# Altium schematic sheet BatteryCharger.SchDoc
size A3; SheetNumber: 2; SheetTotal: 8
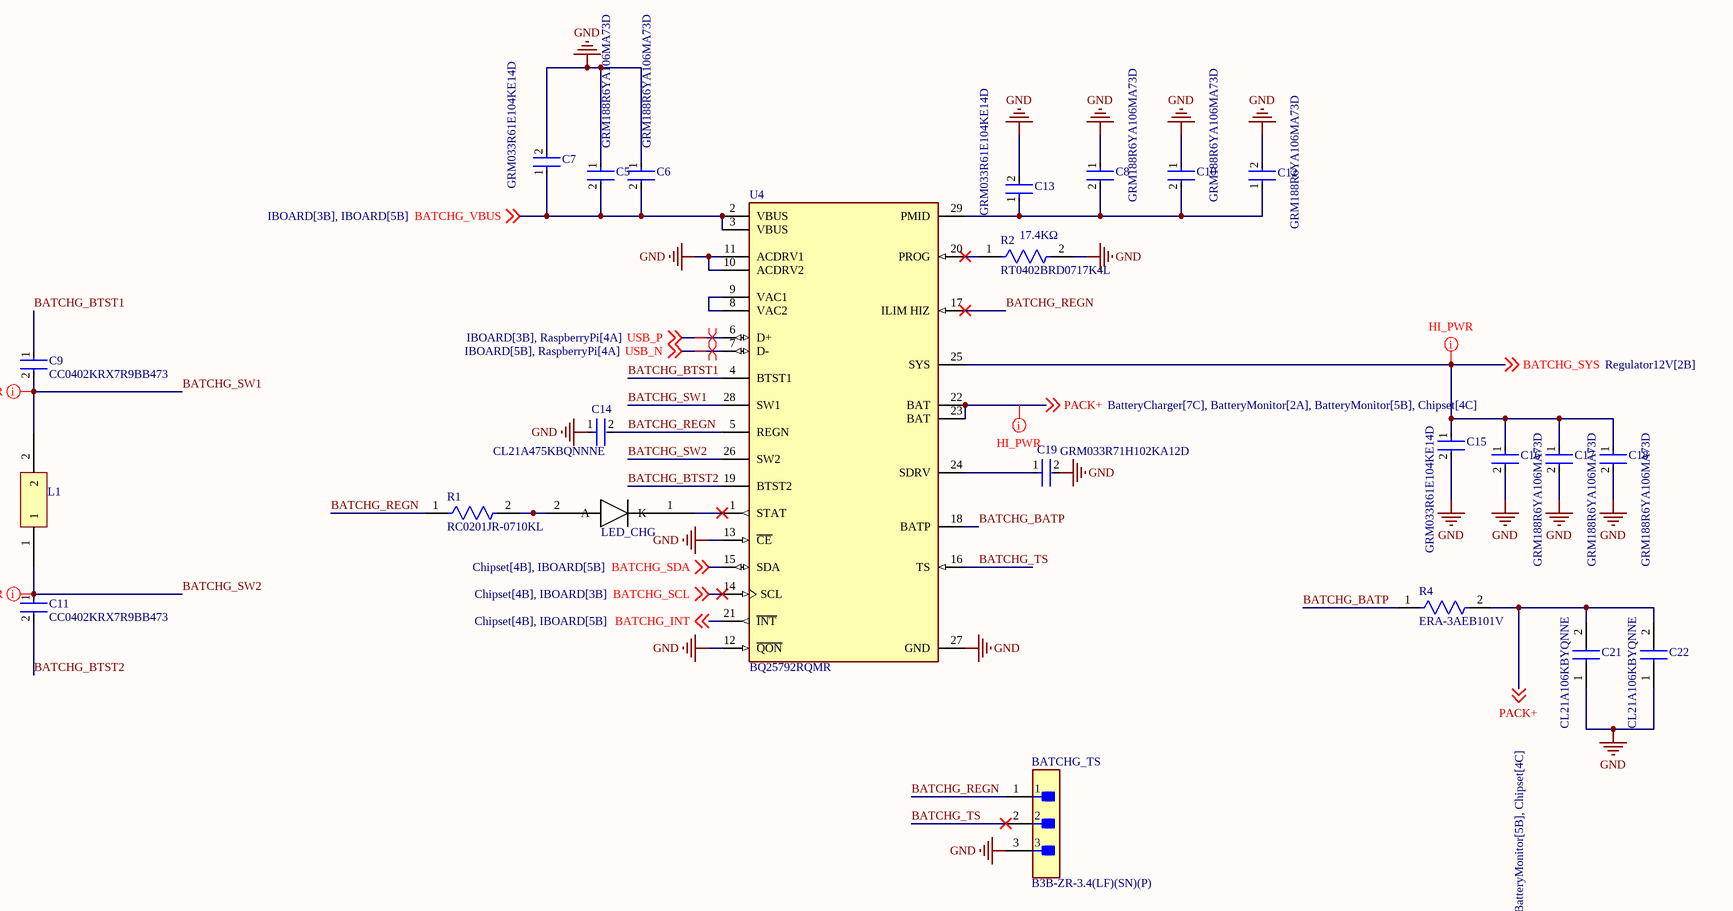
[diagram p0: BatteryCharger.SchDoc]

## Parts
BATCHG_TS  B3B-ZR-3.4(LF)(SN)(P)  [FP-B3B-ZR-3_4_LF_SN_P-MFG]
C5  GRM188R6YA106MA73D  [FP-GRM188-0_2-IPC_C]
C6  GRM188R6YA106MA73D  [FP-GRM188-0_2-IPC_C]
C7  GRM033R61E104KE14D  [FP-GRM033-0_03-IPC_B]
C8  GRM188R6YA106MA73D  [FP-GRM188-0_2-IPC_C]
C9  CC0402KRX7R9BB473  [FP-CC0402-MFG]
C10  GRM188R6YA106MA73D  [FP-GRM188-0_2-IPC_C]
C11  CC0402KRX7R9BB473  [FP-CC0402-MFG]
C12  GRM188R6YA106MA73D  [FP-GRM188-0_2-IPC_C]
C13  GRM033R61E104KE14D  [FP-GRM033-0_03-IPC_B]
C14  CL21A475KBQNNNE  [FP-CL21-IPC_C]
C15  GRM033R61E104KE14D  [FP-GRM033-0_03-IPC_B]
C16  GRM188R6YA106MA73D  [FP-GRM188-0_2-IPC_C]
C17  GRM188R6YA106MA73D  [FP-GRM188-0_2-IPC_C]
C18  GRM188R6YA106MA73D  [FP-GRM188-0_2-IPC_C]
C19  GRM033R71H102KA12D  [FP-GRM033-0_03-IPC_A]
C21  CL21A106KBYQNNE  [CAPC2012X145N]
C22  CL21A106KBYQNNE  [CAPC2012X145N]
L1  SPM6530T-1R0M120  [SPM6530T-1R0M120]  (value not drawn)
LED_CHG  XL-1608SURC-06  [XL-1608SURC-06]  (value not drawn)
R1  RC0201JR-0710KL  [FP-RC0201-0_26-IPC_C]
R2  RT0402BRD0717K4L  Resistance: 17.4KΩ  [FP-RT0402-MFG]
R4  ERA-3AEB101V  [FP-ERA3A-IPC_B]
U4  BQ25792RQMR  [FP-RQM0029A-MFG]

## Nets
GND: BATCHG_TS.3 C5.1 C6.1 C7.2 C8.1 C10.1 C12.2 C13.2 C14.1 C15.2 C16.2 C17.2 C18.2 C19.2 C21.1 C22.1 R2.2 U4.10(ACDRV2) U4.11(ACDRV1) U4.12(~{QON}) U4.13(~{CE}) U4.27(GND)
BATCHG_BATP: R4.1 U4.18(BATP)
BATCHG_BTST1: C9.1 U4.4(BTST1)
BATCHG_BTST2: C11.2 U4.19(BTST2)
BATCHG_INT: U4.21(~{INT}) ; off-sheet BATCHG_INT
BATCHG_REGN: BATCHG_TS.1 C14.2 R1.1 U4.5(REGN) U4.17(ILIM_HIZ)
BATCHG_SCL: U4.14(SCL) ; off-sheet BATCHG_SCL
BATCHG_SDA: U4.15(SDA) ; off-sheet BATCHG_SDA
BATCHG_SW1: C9.2 L1.2 U4.28(SW1)
BATCHG_SW2: C11.1 L1.1 U4.26(SW2)
BATCHG_SYS: C15.1 C16.1 C17.1 C18.1 U4.25(SYS) ; off-sheet BATCHG_SYS
BATCHG_TS: BATCHG_TS.2 U4.16(TS)
BATCHG_VBUS: C5.2 C6.2 C7.1 U4.2(VBUS) U4.3(VBUS) ; off-sheet BATCHG_VBUS
PACK+: C21.2 C22.2 R4.2 U4.22(BAT) U4.23(BAT) ; off-sheet PACK+
USB_N: U4.7(D-) ; off-sheet USB_N
USB_P: U4.6(D+) ; off-sheet USB_P
NetC8_2: C8.2 C10.2 C12.1 C13.1 U4.29(PMID)
NetC19_1: C19.1 U4.24(SDRV)
NetLED_CHG_1: LED_CHG.1(K) U4.1(STAT)
NetLED_CHG_2: LED_CHG.2(A) R1.2
NetR2_1: R2.1 U4.20(PROG)
NetU4_8: U4.8(VAC2) U4.9(VAC1)

## Layout directives
net class HI_PWR: BATCHG_SW1, BATCHG_SW2, BATCHG_SYS, PACK+
differential pair: USB_N, USB_P

## Library data of the parts
BATCHG_TS = CMP-17439-000712-1: CONN HEADER VERT 3POS 1.5MM; Mated Stacking Heights: 5.6mm; Voltage Rating (AC): 50V; Number of Positions: 3; Number of Rows: 1; Connector Type: Header; Max Operating Temperature: 85°C; Min Operating Temperature: -25°C; Insulation Material: Nylon; Insulation Color: Natural; Contact Finish - Mating: TIN; Series: ZH; Packaging: Bulk; Contact Material: Brass; Fastening Type: Detent; Contact Shape: Circular; Contact Type: Male Pin; Flammability Rating: UL94 V-0; Mount: Through Hole; Termination: Press-Fit
C5 C6 C8 C10 C12 C16-C18 = CMP-06035-045466-1: Chip Multilayer Ceramic Capacitors for General Purpose, 0603, 10uF, X5R, 15%, 20%, 35V; Case Code (Imperial): 0603; Voltage Rating (DC): 35V; Width: 0.031inch; Dielectric: X5R; Voltage Rating: 35V; Min Operating Temperature: -55°C; Thickness: 0.039inch; Mount: Surface Mount; Case/Package: 0603; Length: 0.063inch; Capacitance: 10uF; Max Operating Temperature: 85°C; Packaging: Tape and Reel; Tolerance: 20%; Case Code (Metric): 1608
C7 C13 C15 = CMP-06035-036234-1: Chip Multilayer Ceramic Capacitors for General Purpose, 0201, 0.10uF, X5R, 15%, 10%, 25V; Capacitance: 100nF; Case/Package: 0201; Mount: Surface Mount; Resistor Type: Ceramic; Package Quantity: 15000; Height: 0.3mm; Length: 0.024inch; Weight: 1.2E-05oz; Dielectric: X5R; Thickness: 0.013inch; Max Operating Temperature: 85°C; Case Code (Imperial): 0201; Voltage Rating: 25V; Case Code (Metric): 0603; Voltage Rating (DC): 25V; Width: 0.012inch; Termination: SMD/SMT; Tolerance: 10%; Min Operating Temperature: -55°C; Packaging: Tape and Reel; Lead Free: Lead Free
C9 C11 = CMP-03422-000113-1: CAP CER 0.047UF 50V X7R 0402; Manufacturer: YAGEO; Material: Ceramic; Value: 47 nF; Automotive Grade: NA; Tolerance: 0.1; Temperature Coefficient: 30ppm/°C; Height: 0.55mm; Footprint Url: http://www.yageo.com/exep/pages/download/literatures/UPY-C_GEN_24.pdf; Voltage Rating: 50 V; Ipc Land Pattern Name: CAPC10050X50; Octopart: https://octopart.com/cc0402krx7r9bb473-yageo-68083038; ComponentLink2URL: http://www.yageo.com/documents/recent/UPY-GP_NP0_16V-to-50V_16.pdf; Device Class L2: Capacitors; Automotive: No; Capacitance: 47 nF; Device Class L3: Ceramic Capacitors; Temperature Range Low: -55°C; Temperature: -55°C to +125°C; Temperature Characteristic: X7R; Digikey Description: CAP CER 0.047UF 50V X7R 0402; Category: Cap; Package: CC0402; Device Class L1: Passive Components; Temperature Range High: +125°C; Manufacturer Part Number: CC0402KRX7R9BB473; RoHS: TRUE; Mouser Description: CC Series 0402 0.047 uF 50 V ±10% Tolerance X7R Multilayer Ceramic Capacitor; ComponentLink2Description: Datasheet; Lead Free: Yes
C14 = CMP-13271-004306-1: CL21 Series 0805 4.7uF 50V ±10% Tolerance X5R Multilayer Ceramic Chip Capacitor; Max Operating Temperature: 85°C; Case Code (Metric): 2012; Voltage Rating: 50V; Case Code (Imperial): 0805; Dielectric: X5R; Depth: 1.25mm; Mount: Surface Mount; Length: 2mm; Radiation Hardening: No; Width: 0.049inch; Package Quantity: 1; Packaging: Tape and Reel; Capacitance: 4.7uF; Min Operating Temperature: -55°C; Thickness: 0.055inch; Case/Package: 0805; RoHS Compliant: Yes; Series: CL; Tolerance: 10%
C19 = CMP-06035-000519-1: Chip Multilayer Ceramic Capacitors for General Purpose, 0201, 1000pF, X7R, 15%, 10%, 50V; Capacitance: 1nF; Tolerance: 10%; Width: 0.012inch; Height: 0.3mm; Dielectric: X7R; Case Code (Metric): 0603; Length: 0.024inch; Package Quantity: 15000; Resistor Type: Ceramic; Case/Package: 0201; Case Code (Imperial): 0201; Termination: SMD/SMT; Packaging: Tape and Reel; Min Operating Temperature: -55°C; Max Operating Temperature: 125°C; Voltage Rating (DC): 50V; Weight: 1.2E-05oz; Lead Free: Lead Free; Voltage Rating: 50V; Mount: Surface Mount; Thickness: 0.013inch
C21 C22 = CL21A106KBYQNNE: Capacitor; Manufacturer_Name: SAMSUNG; Height: 1.45mm; Manufacturer_Part_Number: CL21A106KBYQNNE; Arrow Part Number: CL21A106KBYQNNE; Arrow Price/Stock: https://www.arrow.com/en/products/cl21a106kbyqnne/samsung-electro-mechanics?region=nac
R1 = CMP-03412-037826-1: RES SMD 10K OHM 5% 1/20W 0201; Voltage Rating: 25V; Max Power Dissipation: 50mW; Temperature Coefficient: 200ppm/°C; Resistance: 10kR; Min Operating Temperature: -55°C; Packaging: Tape and Reel; Tolerance: 5%; Length: 0.6mm; Contact Plating: Tin; Features: Moisture Resistant; Radiation Hardening: No; Military Standard: Not; Voltage Rating (DC): 25V; Termination: SMD/SMT; Size Code: 0201; Resistance Tolerance: 5%; Case Code (Imperial): 0201; Resistor Type: Thick Film; Depth: 0.3mm; Series: RC; Lead Free: Lead Free; Power Rating: 50mW; Number of Terminations: 2; Case Code (Metric): 0603; RoHS Compliant: Yes; Max Operating Temperature: 125°C; Construction: Rectangular; Case/Package: 0201
R2 = CMP-03412-007418-1: RES SMD 17.4K OHM 0.1% 1/16W; Manufacturer: Yageo; Temperature Coefficient: 25 ppm/°C; Voltage Rating: 50V; Power Rating: 0.063W; Tolerance: 0.001; Value: 17.4KΩ; Temperature Range High: +155°C; Series: RT; Ipc Land Pattern Name: RESC10050X30; Height: 0.35mm; Package: RT0402; Manufacturer Part Number: RT0402BRD0717K4L; Octopart: https://octopart.com/rt0402brd0717k4l-yageo-1251600; ComponentLink2URL: http://www.yageo.com/documents/recent/PYu-RT_1-to-0.01_RoHS_L_9.pdf; Digikey Description: RES SMD 17.4K OHM 0.1% 1/16W; RoHS: TRUE; Device Class L1: Passive Components; Lead Free: Yes; Temperature Range Low: -55°C; Device Class L3: Chip SMD Resistors; Temperature: -55°C to +155°C; Automotive: No; Category: Res; Composition: Thin Film; Mouser Description: Res Thin Film 0402 17.4K Ohm 0.1% 1/16W ±25ppm/°C Molded SMD Paper T/R; Device Class L2: Resistors; ComponentLink2Description: Datasheet; Footprint Url: http://www.yageo.com/exep/pages/download/literatures/PYu-R_Mount_10.pdf
R4 = CMP-2000-00870-2: RES SMD 100 OHM 0.1% 1/10W 0603; Voltage Rating: 75V; Power Rating: 100mW; Resistance: 100R; Temperature Coefficient: 25ppm/°C; Number of Terminations: 2; Case/Package: 0603; Termination: SMD/SMT; Number of Pins: 2; Size Code: 0603; Length: 1.6mm; Min Operating Temperature: -55°C; Resistor Type: Thin Film; Depth: 0.8mm; Military Standard: Not; Packaging: Tape and Reel; RoHS Compliant: Yes; Construction: Rectangular; Resistance Tolerance: 0.1%; Contact Plating: Tin; Width: 0.8mm; Mount: Surface Mount; Case Code (Metric): 1608; Max Operating Temperature: 155°C; Height: 0.45mm; Case Code (Imperial): 0603; Series: ERA-3A; Package Quantity: 5000; REACH SVHC: No SVHC; Tolerance: 0.1%; Max Power Dissipation: 100mW; Radiation Hardening: No; Technology: METAL FILM
U4 = CMP-04911-000031-1: I2C CONTROLLED, 5-A, 1-4 CELL BU; RoHS Compliant: Yes